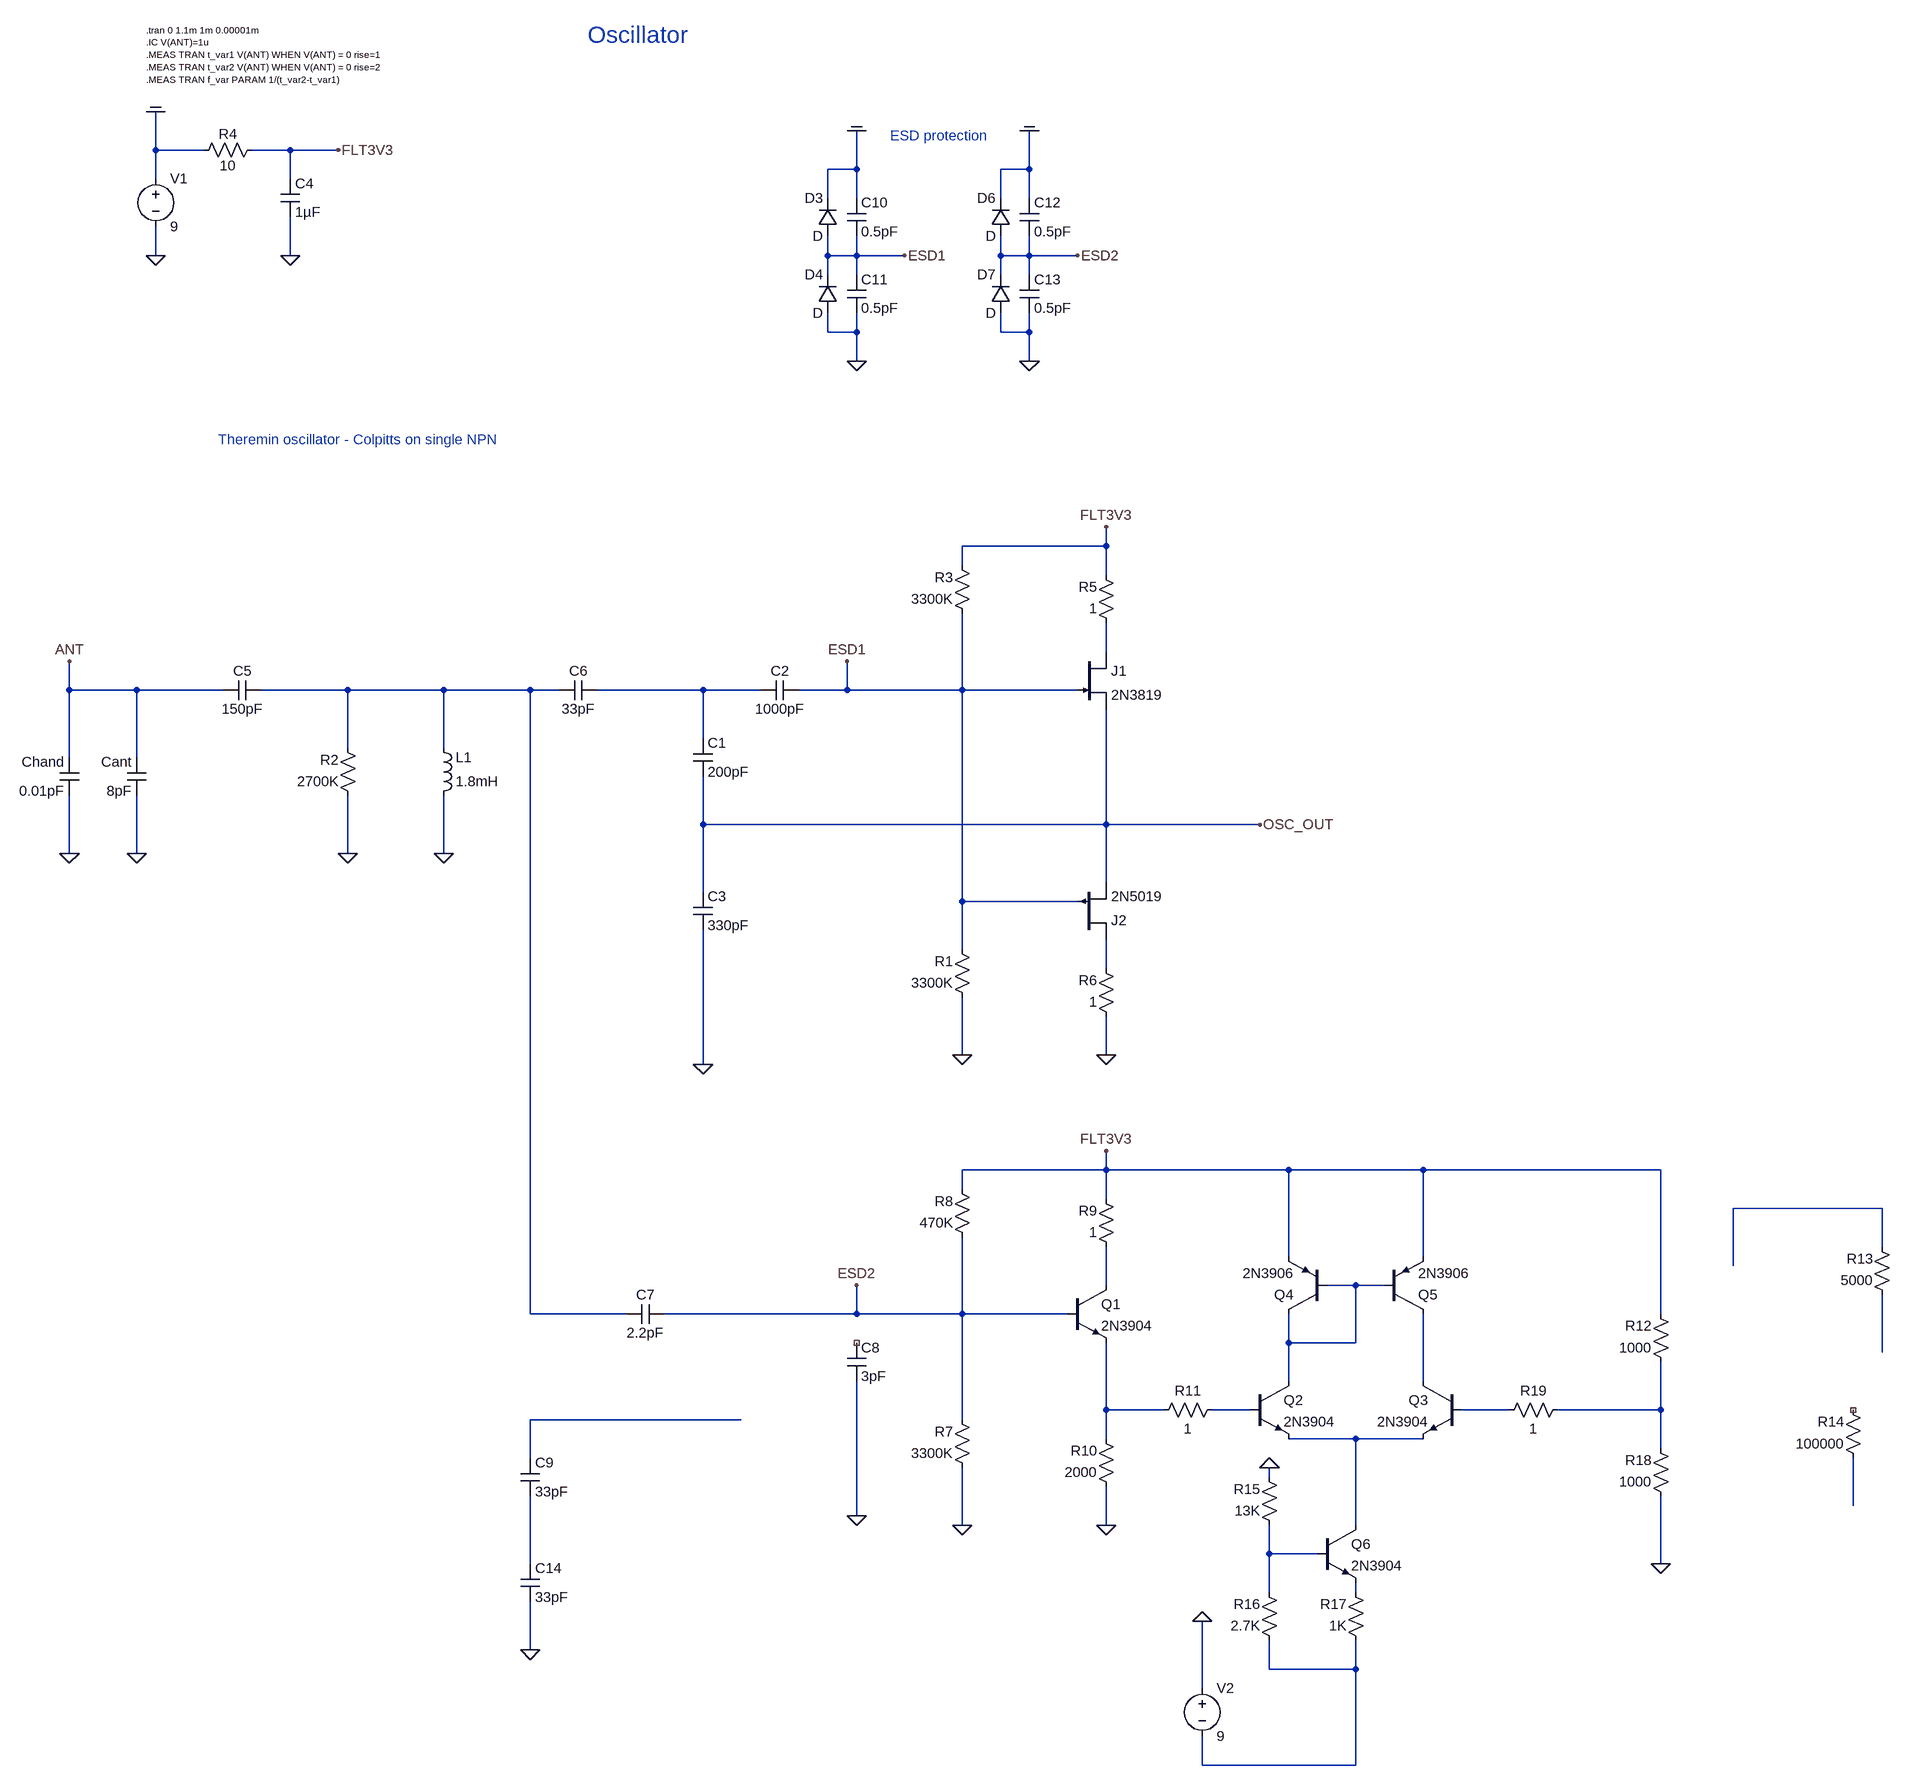
[diagram p0: schematic 2020_jfet_bridge_osc_v3.asc]
2020_jfet_bridge_osc_v3.asc, the LTspice schematic file:
Version 4
SHEET 1 2908 2724
WIRE -1056 -336 -1056 -400
WIRE -976 -336 -1056 -336
WIRE -832 -336 -896 -336
WIRE -752 -336 -832 -336
WIRE 112 -304 112 -368
WIRE 112 -304 64 -304
WIRE 400 -304 400 -368
WIRE 400 -304 352 -304
WIRE -1056 -288 -1056 -336
WIRE -832 -288 -832 -336
WIRE 64 -256 64 -304
WIRE 112 -256 112 -304
WIRE 352 -256 352 -304
WIRE 400 -256 400 -304
WIRE -1056 -160 -1056 -208
WIRE -832 -160 -832 -224
WIRE 64 -160 64 -192
WIRE 112 -160 112 -192
WIRE 112 -160 64 -160
WIRE 192 -160 112 -160
WIRE 352 -160 352 -192
WIRE 400 -160 400 -192
WIRE 400 -160 352 -160
WIRE 480 -160 400 -160
WIRE 64 -128 64 -160
WIRE 112 -128 112 -160
WIRE 352 -128 352 -160
WIRE 400 -128 400 -160
WIRE 64 -32 64 -64
WIRE 112 -32 112 -64
WIRE 112 -32 64 -32
WIRE 352 -32 352 -64
WIRE 400 -32 400 -64
WIRE 400 -32 352 -32
WIRE 112 16 112 -32
WIRE 400 16 400 -32
WIRE 528 448 528 416
WIRE 528 448 288 448
WIRE 288 480 288 448
WIRE 528 496 528 448
WIRE 528 624 528 576
WIRE -1200 688 -1200 640
WIRE -1088 688 -1200 688
WIRE -944 688 -1088 688
WIRE -736 688 -880 688
WIRE -576 688 -736 688
WIRE -432 688 -576 688
WIRE -384 688 -432 688
WIRE -144 688 -320 688
WIRE -48 688 -144 688
WIRE 96 688 96 640
WIRE 96 688 16 688
WIRE 288 688 288 560
WIRE 288 688 96 688
WIRE 480 688 288 688
WIRE -144 768 -144 688
WIRE -736 784 -736 688
WIRE -576 784 -576 688
WIRE -1200 800 -1200 688
WIRE -1088 800 -1088 688
WIRE -144 912 -144 832
WIRE 528 912 528 720
WIRE 528 912 -144 912
WIRE 784 912 528 912
WIRE -1200 960 -1200 864
WIRE -1088 960 -1088 864
WIRE -736 960 -736 864
WIRE -576 960 -576 864
WIRE 528 1008 528 912
WIRE -144 1024 -144 912
WIRE 288 1040 288 688
WIRE 480 1040 288 1040
WIRE 288 1120 288 1040
WIRE 528 1152 528 1104
WIRE 288 1296 288 1200
WIRE 528 1296 528 1232
WIRE -144 1312 -144 1088
WIRE 528 1488 528 1456
WIRE 528 1488 288 1488
WIRE 832 1488 528 1488
WIRE 1056 1488 832 1488
WIRE 1504 1488 1056 1488
WIRE 288 1520 288 1488
WIRE 528 1536 528 1488
WIRE 2016 1552 1728 1552
WIRE 2016 1616 2016 1552
WIRE 832 1632 832 1488
WIRE 1056 1632 1056 1488
WIRE 1728 1648 1728 1552
WIRE 528 1680 528 1616
WIRE 944 1680 896 1680
WIRE 992 1680 944 1680
WIRE -432 1728 -432 688
WIRE -272 1728 -432 1728
WIRE 112 1728 112 1680
WIRE 112 1728 -208 1728
WIRE 288 1728 288 1600
WIRE 288 1728 112 1728
WIRE 464 1728 288 1728
WIRE 1504 1728 1504 1488
WIRE 832 1776 832 1728
WIRE 944 1776 944 1680
WIRE 944 1776 832 1776
WIRE 2016 1792 2016 1696
WIRE 832 1840 832 1776
WIRE 1056 1840 1056 1728
WIRE 528 1888 528 1776
WIRE 624 1888 528 1888
WIRE 768 1888 704 1888
WIRE 1200 1888 1120 1888
WIRE 1504 1888 1504 1808
WIRE 1504 1888 1280 1888
WIRE -80 1904 -432 1904
WIRE 288 1904 288 1728
WIRE 528 1936 528 1888
WIRE 944 1936 832 1936
WIRE 1056 1936 944 1936
WIRE 1504 1952 1504 1888
WIRE -432 1968 -432 1904
WIRE 800 2000 800 1984
WIRE 1968 2048 1968 1968
WIRE 112 2064 112 1840
WIRE 288 2080 288 1984
WIRE 528 2080 528 2016
WIRE 944 2080 944 1936
WIRE 800 2128 800 2080
WIRE 880 2128 800 2128
WIRE -432 2144 -432 2032
WIRE 1504 2144 1504 2032
WIRE 800 2192 800 2128
WIRE 944 2192 944 2176
WIRE -432 2288 -432 2208
WIRE 800 2320 800 2272
WIRE 944 2320 944 2272
WIRE 944 2320 800 2320
WIRE 688 2352 688 2240
WIRE 688 2480 688 2432
WIRE 944 2480 944 2320
WIRE 944 2480 688 2480
FLAG -1056 -160 0
FLAG -1200 960 0
FLAG -1200 640 ANT
FLAG -1056 -400 COM
FLAG 112 16 0
FLAG 112 -368 COM
FLAG 192 -160 ESD1
FLAG 400 16 0
FLAG 400 -368 COM
FLAG 480 -160 ESD2
FLAG -1088 960 0
FLAG 96 640 ESD1
FLAG -832 -160 0
FLAG -736 960 0
FLAG -576 960 0
FLAG -752 -336 FLT3V3
FLAG 528 416 FLT3V3
FLAG 784 912 OSC_OUT
FLAG -144 1312 0
FLAG 288 1296 0
FLAG 112 1680 ESD2
FLAG 528 1296 0
FLAG 528 1456 FLT3V3
FLAG 288 2080 0
FLAG 528 2080 0
FLAG 112 2064 0
FLAG -432 2288 0
FLAG 688 2240 0
FLAG 1504 2144 0
FLAG 800 1984 0
SYMBOL voltage -1056 -304 R0
WINDOW 123 0 0 Left 2
WINDOW 39 0 0 Left 2
SYMATTR InstName V1
SYMATTR Value 9
SYMBOL ind -592 880 M180
WINDOW 0 36 80 Left 2
WINDOW 3 36 40 Left 2
SYMATTR InstName L1
SYMATTR Value 1.8mH
SYMATTR SpiceLine Ipk=0.1 Rser=32 Rpar=20Meg Cpar=1.286pF
SYMBOL cap -1184 800 M0
SYMATTR InstName Chand
SYMATTR Value 0.01pF
SYMBOL diode 80 -192 R180
WINDOW 0 24 64 Left 2
WINDOW 3 24 0 Left 2
SYMATTR InstName D3
SYMBOL diode 80 -64 R180
WINDOW 0 24 64 Left 2
WINDOW 3 24 0 Left 2
SYMATTR InstName D4
SYMBOL cap 96 -256 R0
SYMATTR InstName C10
SYMATTR Value 0.5pF
SYMBOL cap 96 -128 R0
SYMATTR InstName C11
SYMATTR Value 0.5pF
SYMBOL diode 368 -192 R180
WINDOW 0 24 64 Left 2
WINDOW 3 24 0 Left 2
SYMATTR InstName D6
SYMBOL diode 368 -64 R180
WINDOW 0 24 64 Left 2
WINDOW 3 24 0 Left 2
SYMATTR InstName D7
SYMBOL cap 384 -256 R0
SYMATTR InstName C12
SYMATTR Value 0.5pF
SYMBOL cap 384 -128 R0
SYMATTR InstName C13
SYMATTR Value 0.5pF
SYMBOL cap -1072 800 M0
SYMATTR InstName Cant
SYMATTR Value 8pF
SYMBOL res -880 -352 R90
WINDOW 0 5 56 VBottom 2
WINDOW 3 27 56 VTop 2
SYMATTR InstName R4
SYMATTR Value 10
SYMBOL cap -848 -288 R0
SYMATTR InstName C4
SYMATTR Value 1µF
SYMBOL res 304 1216 R180
WINDOW 0 31 76 Left 2
WINDOW 3 31 40 Left 2
SYMATTR InstName R1
SYMATTR Value 3300K
SYMBOL res -720 880 R180
WINDOW 0 31 76 Left 2
WINDOW 3 31 40 Left 2
SYMATTR InstName R2
SYMATTR Value 2700K
SYMBOL cap -160 768 R0
SYMATTR InstName C1
SYMATTR Value 200pF
SYMBOL cap -160 1024 R0
SYMATTR InstName C3
SYMATTR Value 330pF
SYMBOL res 304 576 R180
WINDOW 0 31 76 Left 2
WINDOW 3 31 40 Left 2
SYMATTR InstName R3
SYMATTR Value 3300K
SYMBOL njf 480 624 R0
SYMATTR InstName J1
SYMATTR Value 2N3819
SYMBOL pjf 480 1104 M180
SYMATTR InstName J2
SYMATTR Value 2N5019
SYMBOL cap -880 672 R90
WINDOW 0 0 32 VBottom 2
WINDOW 3 32 32 VTop 2
SYMATTR InstName C5
SYMATTR Value 150pF
SYMBOL cap -320 672 R90
WINDOW 0 0 32 VBottom 2
WINDOW 3 32 32 VTop 2
SYMATTR InstName C6
SYMATTR Value 33pF
SYMBOL cap 16 672 R90
WINDOW 0 0 32 VBottom 2
WINDOW 3 32 32 VTop 2
SYMATTR InstName C2
SYMATTR Value 1000pF
SYMBOL res 544 592 R180
WINDOW 0 31 76 Left 2
WINDOW 3 31 40 Left 2
SYMATTR InstName R5
SYMATTR Value 1
SYMBOL res 544 1248 R180
WINDOW 0 31 76 Left 2
WINDOW 3 31 40 Left 2
SYMATTR InstName R6
SYMATTR Value 1
SYMBOL res 304 2000 R180
WINDOW 0 31 76 Left 2
WINDOW 3 31 40 Left 2
SYMATTR InstName R7
SYMATTR Value 3300K
SYMBOL res 304 1616 R180
WINDOW 0 31 76 Left 2
WINDOW 3 31 40 Left 2
SYMATTR InstName R8
SYMATTR Value 470K
SYMBOL res 544 1632 R180
WINDOW 0 31 76 Left 2
WINDOW 3 31 40 Left 2
SYMATTR InstName R9
SYMATTR Value 1
SYMBOL res 544 2032 R180
WINDOW 0 31 76 Left 2
WINDOW 3 31 40 Left 2
SYMATTR InstName R10
SYMATTR Value 2000
SYMBOL cap -208 1712 R90
WINDOW 0 0 32 VBottom 2
WINDOW 3 32 32 VTop 2
SYMATTR InstName C7
SYMATTR Value 2.2pF
SYMBOL npn 464 1680 R0
SYMATTR InstName Q1
SYMATTR Value 2N3904
SYMBOL cap 96 1776 R0
SYMATTR InstName C8
SYMATTR Value 3pF
SYMBOL npn 768 1840 R0
SYMATTR InstName Q2
SYMATTR Value 2N3904
SYMBOL cap -448 1968 R0
SYMATTR InstName C9
SYMATTR Value 33pF
SYMBOL cap -448 2144 R0
SYMATTR InstName C14
SYMATTR Value 33pF
SYMBOL res 1520 1824 R180
WINDOW 0 31 76 Left 2
WINDOW 3 31 40 Left 2
SYMATTR InstName R12
SYMATTR Value 1000
SYMBOL res 2032 1712 R180
WINDOW 0 31 76 Left 2
WINDOW 3 31 40 Left 2
SYMATTR InstName R13
SYMATTR Value 5000
SYMBOL res 1984 1984 R180
WINDOW 0 31 76 Left 2
WINDOW 3 31 40 Left 2
SYMATTR InstName R14
SYMATTR Value 100000
SYMBOL npn 1120 1840 M0
SYMATTR InstName Q3
SYMATTR Value 2N3904
SYMBOL res 1520 2048 R180
WINDOW 0 31 76 Left 2
WINDOW 3 31 40 Left 2
SYMATTR InstName R18
SYMATTR Value 1000
SYMBOL res 608 1904 R270
WINDOW 0 32 56 VTop 2
WINDOW 3 0 56 VBottom 2
SYMATTR InstName R11
SYMATTR Value 1
SYMBOL res 1184 1904 R270
WINDOW 0 32 56 VTop 2
WINDOW 3 0 56 VBottom 2
SYMATTR InstName R19
SYMATTR Value 1
SYMBOL voltage 688 2336 R0
WINDOW 123 0 0 Left 2
WINDOW 39 0 0 Left 2
SYMATTR InstName V2
SYMATTR Value 9
SYMBOL pnp 896 1728 R180
SYMATTR InstName Q4
SYMATTR Value 2N3906
SYMBOL pnp 992 1728 M180
SYMATTR InstName Q5
SYMATTR Value 2N3906
SYMBOL npn 880 2080 R0
SYMATTR InstName Q6
SYMATTR Value 2N3904
SYMBOL res 816 2096 R180
WINDOW 0 31 76 Left 2
WINDOW 3 31 40 Left 2
SYMATTR InstName R15
SYMATTR Value 13K
SYMBOL res 816 2288 R180
WINDOW 0 31 76 Left 2
WINDOW 3 31 40 Left 2
SYMATTR InstName R16
SYMATTR Value 2.7K
SYMBOL res 960 2288 R180
WINDOW 0 31 76 Left 2
WINDOW 3 31 40 Left 2
SYMATTR InstName R17
SYMATTR Value 1K
TEXT -1072 -536 Left 1 !.tran 0 1.1m 1m 0.00001m\n.IC V(ANT)=1u\n.MEAS TRAN t_var1 V(ANT) WHEN V(ANT) = 0 rise=1\n.MEAS TRAN t_var2 V(ANT) WHEN V(ANT) = 0 rise=2\n.MEAS TRAN f_var PARAM 1/(t_var2-t_var1)
TEXT 168 -360 Left 2 ;ESD protection
TEXT -336 -528 Left 4 ;Oscillator
TEXT -952 240 Left 2 ;Theremin oscillator - Colpitts on single NPN

The netlist it stands for:
* 2020_jfet_bridge_osc_v3.asc
V1 COM 0 9
L1 0 N002 1.8mH Ipk=0.1 Rser=32 Rpar=20Meg Cpar=1.286pF
Chand ANT 0 0.01pF
D3 ESD1 COM D
D4 0 ESD1 D
C10 COM ESD1 0.5pF
C11 ESD1 0 0.5pF
D6 ESD2 COM D
D7 0 ESD2 D
C12 COM ESD2 0.5pF
C13 ESD2 0 0.5pF
Cant ANT 0 8pF
R4 FLT3V3 COM 10
C4 FLT3V3 0 1µF
R1 0 ESD1 3300K
R2 0 N002 2700K
C1 N003 OSC_OUT 200pF
C3 OSC_OUT 0 330pF
R3 ESD1 FLT3V3 3300K
J1 N001 ESD1 OSC_OUT 2N3819
J2 N004 ESD1 OSC_OUT 2N5019
C5 N002 ANT 150pF
C6 N003 N002 33pF
C2 ESD1 N003 1000pF
R5 N001 FLT3V3 1
R6 0 N004 1
R7 0 ESD2 3300K
R8 ESD2 FLT3V3 470K
R9 N006 FLT3V3 1
R10 0 N010 2000
C7 ESD2 N002 2.2pF
Q1 N006 ESD2 N010 0 2N3904
C8 NC_01 0 3pF
Q2 N007 N011 N015 0 2N3904
C9 N014 N018 33pF
C14 N018 0 33pF
R12 N013 FLT3V3 1000
R13 N008 N005 5000
R14 N016 NC_02 100000
Q3 N009 N012 N015 0 2N3904
R18 0 N013 1000
R11 N010 N011 1
R19 N012 N013 1
V2 0 N020 9
Q4 N007 N007 FLT3V3 0 2N3906
Q5 N009 N007 FLT3V3 0 2N3906
Q6 N015 N017 N019 0 2N3904
R15 N017 0 13K
R16 N020 N017 2.7K
R17 N020 N019 1K
.model D D
.lib standard.dio
.model NPN NPN
.model PNP PNP
.lib standard.bjt
.model NJF NJF
.model PJF PJF
.lib standard.jft
.tran 0 1.1m 1m 0.00001m
.IC V(ANT)=1u
.MEAS TRAN t_var1 V(ANT) WHEN V(ANT) = 0 rise=1
.MEAS TRAN t_var2 V(ANT) WHEN V(ANT) = 0 rise=2
.MEAS TRAN f_var PARAM 1/(t_var2-t_var1)
* ESD protection
* Oscillator
* Theremin oscillator - Colpitts on single NPN
.backanno
.end